# EAGLE design working (EAGLE 9.6.2)
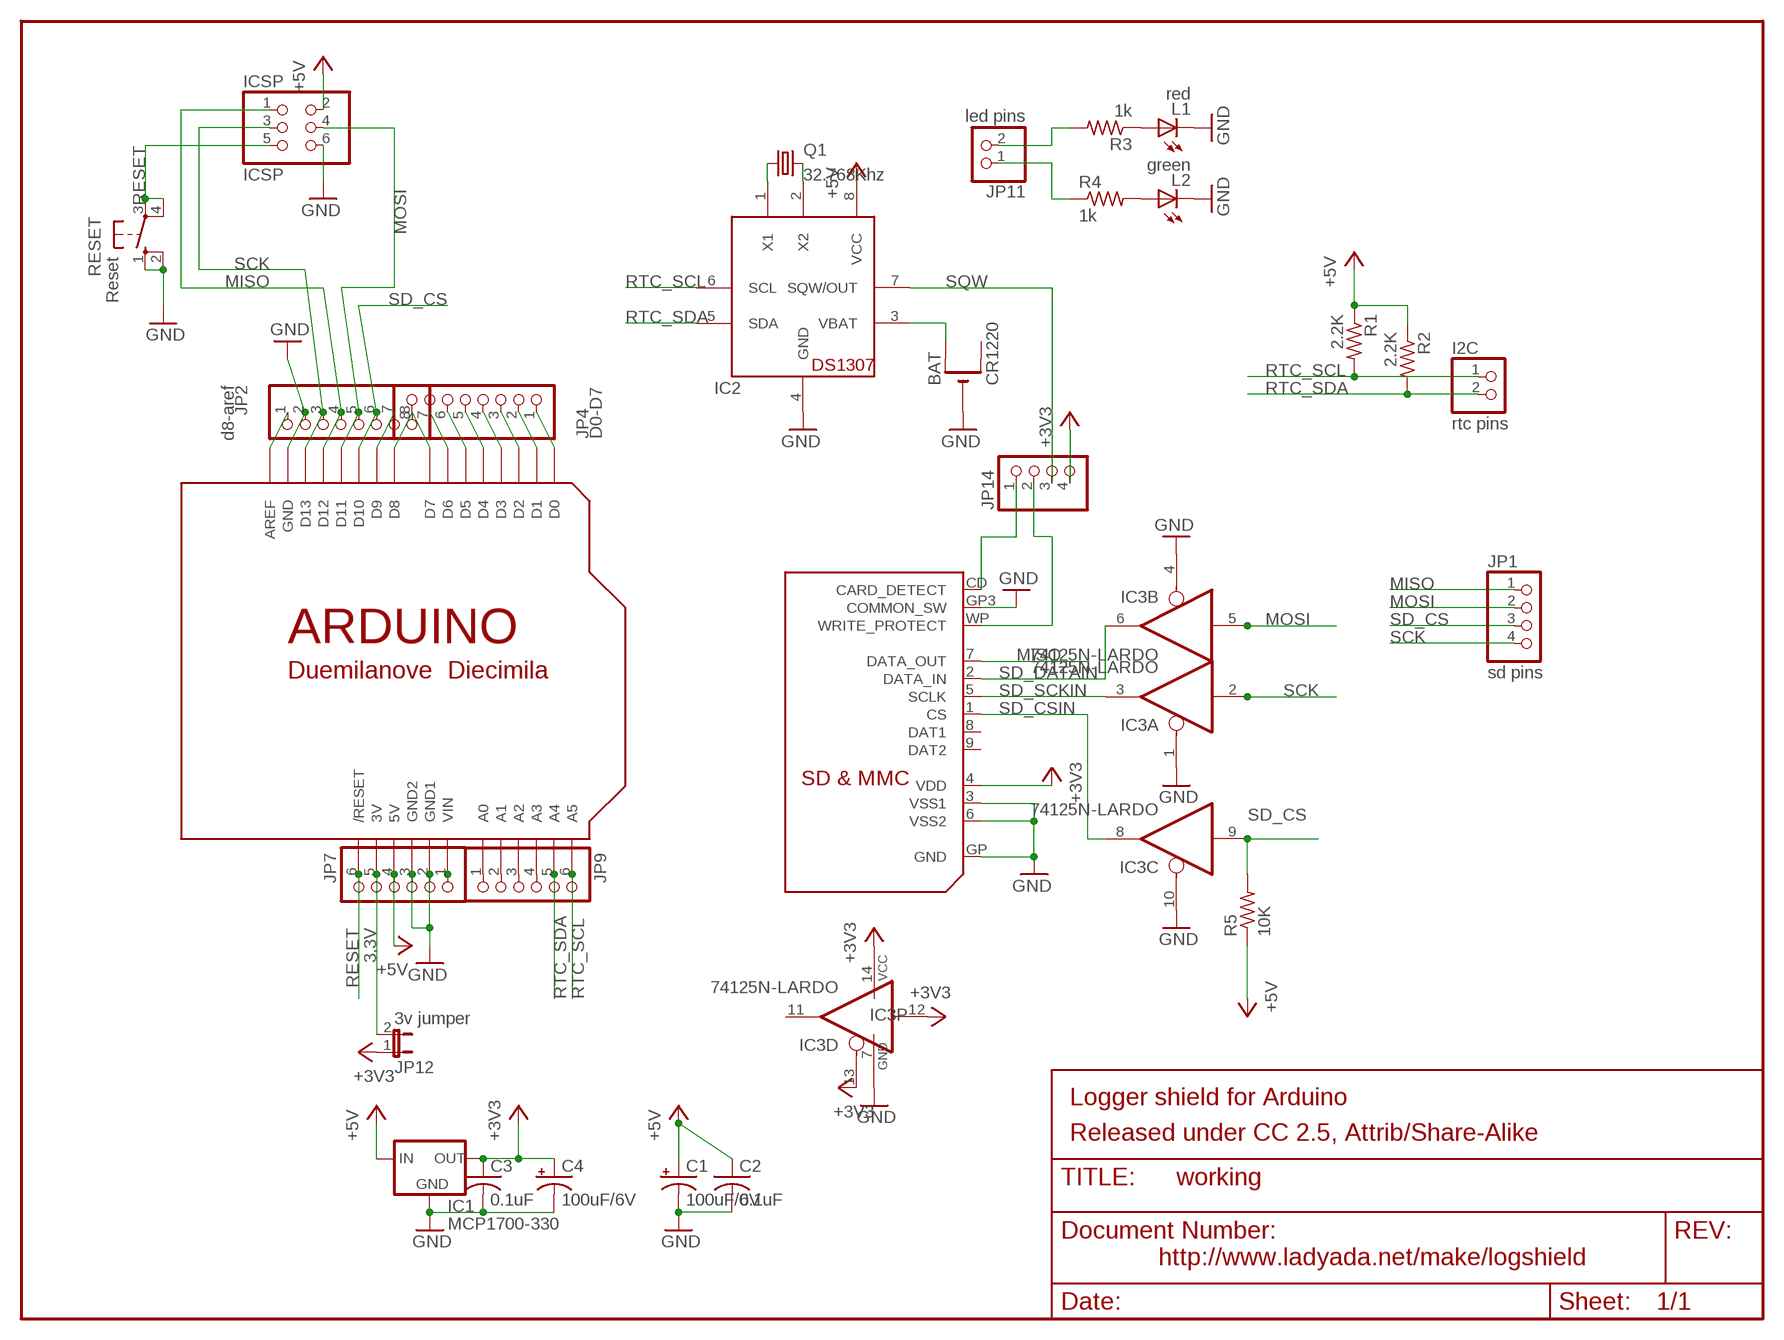
[diagram p0: schematic, sheet 1]

## Parts
BAT  CR1220  CR1220THM  [CR1220-THM]
C1  100uF/6V  CPOL-USE2.5-5  [E2,5-5]
C2  0.1uF  C-US025-025X050  [C025-025X050]
C3  0.1uF  C-US025-025X050  [C025-025X050]
C4  100uF/6V  CPOL-USE2.5-5  [E2,5-5]
I2C  rtc pins  PINHD-1X2  [1X02]
IC1  MCP1700-330  MCP1700TRI  [TO92]
IC2  DS1307  [DIL08]
IC3  74125N-LARDO  [DIL14-LARDO]
ICSP  ICSP  PINHD-2X3  [2X03]
JP1  sd pins  PINHD-1X4  [1X04]
JP2  d8-aref  PINHD-1X8BIG  [1X08-BIG]
JP4  D0-D7  PINHD-1X8BIG  [1X08-BIG]
JP7  PINHD-1X6B  [1X06-BIG]
JP9  PINHD-1X6B  [1X06-BIG]
JP11  led pins  PINHD-1X2  [1X02]
JP12  3v jumper  JP1E  [JP1]
JP14  PINHD-1X4  [1X04]
L1  red  LED3MM  [LED3MM]
L2  green  LED3MM  [LED3MM]
Q1  32.768Khz  CRYSTALTC38H  [TC38H]
R1  2.2K  R-US_0207/10  [0207/10]
R2  2.2K  R-US_0207/10  [0207/10]
R3  1k  R-US_0207/10  [0207/10]
R4  1k  R-US_0207/10  [0207/10]
R5  10K  R-US_0207/10  [0207/10]
RESET  Reset  10-XX  [B3F-10XX]
U$1  ARDUINODUEMILANOVE-NOHOLES  [ARDUINO-NOHOLE]
U$2  SDMMC06132  [06132]

## Nets
3.3V: JP7.5 JP12.2 U$1.3V
+3V3: C3.1 C4.+ IC1.3(OUT) IC3.12(D:I) IC3.13(D:OE) IC3.14(P:VCC) JP12.1 JP14.4 U$2.4(VDD)
+5V: C1.+ C2.1 IC1.2(IN) IC2.8(VCC) ICSP.2 JP7.4 R1.1 R2.1 R5.1 U$1.5V
GND: BAT.- C1.- C2.2 C3.2 C4.- IC1.1(GND) IC2.4(GND) IC3.1(A:OE) IC3.4(B:OE) IC3.7(P:GND) IC3.10(C:OE) ICSP.6 JP2.2 JP7.2 JP7.3 L1.K(C) L2.K(C) RESET.1(S) RESET.2(S1) U$1.GND U$1.GND1 U$1.GND2 U$2.3(VSS1) U$2.6(VSS2) U$2.GP3(COMMON_SW) U$2.GP(GND)
MISO: ICSP.1 JP1.1 JP2.4 U$1.D12 U$2.7(DATA_OUT)
MOSI: IC3.5(B:I) ICSP.4 JP1.2 JP2.5 U$1.D11
N$1: BAT.+1(+) IC2.3(VBAT)
N$2: IC2.1(X1) Q1.1
N$3: IC2.2(X2) Q1.2
N$14: L1.A R3.1
N$15: JP7.1 U$1.VIN
N$17: JP11.2 R3.2
N$18: L2.A R4.2
N$20: JP11.1 R4.1
N$87: JP4.1 U$1.D0
N$88: JP4.2 U$1.D1
N$89: JP4.3 U$1.D2
N$90: JP4.4 U$1.D3
N$98: JP4.5 U$1.D4
N$99: JP4.6 U$1.D5
N$100: JP4.7 U$1.D6
N$101: JP4.8 U$1.D7
N$108: JP2.1 U$1.AREF
N$110: JP2.7 U$1.D9
N$111: JP2.8 U$1.D8
N$154: JP9.1 U$1.A0
N$164: JP9.2 U$1.A1
N$181: JP9.3 U$1.A2
N$182: JP9.4 U$1.A3
RESET: ICSP.5 JP7.6 RESET.3(P) RESET.4(P1) U$1.RESET(/RESET)
RTC_SCL: I2C.1 IC2.6(SCL) JP9.6 R1.2 U$1.A5
RTC_SDA: I2C.2 IC2.5(SDA) JP9.5 R2.2 U$1.A4
SCK: IC3.2(A:I) ICSP.3 JP1.4 JP2.3 U$1.D13
SD_CD: JP14.1 U$2.CD(CARD_DETECT)
SD_CS: IC3.9(C:I) JP1.3 JP2.6 R5.2 U$1.D10
SD_CSIN: IC3.8(C:O) U$2.1(CS)
SD_DATAIN: IC3.6(B:O) U$2.2(DATA_IN)
SD_SCKIN: IC3.3(A:O) U$2.5(SCLK)
SD_WP: JP14.2 U$2.WP(WRITE_PROTECT)
SQW: IC2.7(SQW/OUT) JP14.3
Unconnected: BAT.+2(+1) IC3.11(D:O) U$2.8(DAT1) U$2.9(DAT2)

## Notes on the sheet
- Logger shield for Arduino
- Released under CC 2.5, Attrib/Share-Alike
- http://www.ladyada.net/make/logshield

## Library data of the parts
BAT = adafruit:CR1220: CR1216/CR1220/CR1225 12mm 3V lithium coin cell Great for battery packup. Both SMT and THM holders. Note the THM package has the ground pads on both sides of the PCB so that the masks are the same - this reduces the cost
C1 C4 = adafruit:CPOL-US: POLARIZED CAPACITOR, American symbol
C2 C3 = adafruit:C-US: CAPACITOR, American symbol
I2C JP11 = pinhead:PINHD-1X2: PIN HEADER
IC1 = adafruit:MCP1700: VOLTAGE REGULATOR
IC2 = adafruit:DS1307: DS1307 Real time clock (RTC) with battery backup ability. Talk to it via i2c
IC3 = adafruit:74*125: Quad bus BUFFER, 3-state
ICSP = pinhead:PINHD-2X3: PIN HEADER
JP1 JP14 = pinhead:PINHD-1X4: PIN HEADER
JP2 JP4 = adafruit:PINHD-1X8: PIN HEADER
JP7 JP9 = adafruit:PINHD-1X6: PIN HEADER
JP12 = jumper:JP1E: JUMPER
L1 L2 = adafruit:LED: LED OSRAM: - CHIPLED LG R971, LG N971, LY N971, LG Q971, LY Q971, LO R971, LY R971 LH N974, LH R974 LS Q976, LO Q976, LY Q976 LO Q996 - Hyper CHIPLED LW Q18S LB Q993, LB Q99A, LB R99A - SideLED LS A670, LO A670, LY A670, LG A670, LP A670 LB A673, LV A673, LT A673, LW A673 LH A674 LY A675 LS A676, LA A676, LO A676, LY A676, LW A676 LS A679, LY A679, LG A679 - Hyper Micro SIDELED® LS Y876, LA Y876, LO Y876, LY Y876 LT Y87S - SmartLED LW L88C, LW L88S LB L89C, LB L89S, LG L890 LS L89K, LO L89K, LY L89K LS L896, LA L896, LO L896, LY L896 - TOPLED LS T670, LO T670, LY T670, LG T670, LP T670 LSG T670, LSP T670, LSY T670, LOP T670, LYG T670 LG T671, LOG T671, LSG T671 LB T673, LV T673, LT T673, LW T673 LH T674 LS T676, LA T676, LO T676, LY T676, LB T676, LH T676, LSB T676, LW T676 LB T67C, LV T67C, LT T67C, LS T67K, LO T67K, LY T67K, LW E67C LS E67B, LA E67B, LO E67B, LY E67B, LB E67C, LV E67C, LT E67C LW T67C LS T679, LY T679, LG T679 LS T770, LO T770, LY T770, LG T770, LP T770 LB T773, LV T773, LT T773, LW T773 LH T774 LS E675, LA E675, LY E675, LS T675 LS T776, LA T776, LO T776, LY T776, LB T776 LHGB T686 LT T68C, LB T68C - Hyper Mini TOPLED® LB M676 - Mini TOPLED Santana® LG M470 LS M47K, LO M47K, LY M47K Source: http://www.osram.convergy.de/
Q1 = crystal:CRYSTAL: CRYSTAL
R1-R5 = adafruit:R-US_: RESISTOR, American symbol
RESET = switch-omron:10-XX: OMRON SWITCH
U$1 = adafruit:ARDUINO: Arduino Diecimila/Duemilanove Make a shield with ease, this package has all the named pins as well as the two mounting drill holes and an outline of the USB and DC power connector. The outline is on the DIMENSION layer, so if your board house uses it they will cut the outline to match. http://www.ladyada.net/library/pcb/eaglelibrary.html
U$2 = adafruit:SDMMC: SD MMC Card holder 4UCON part #06132 - easy to solder

## Board
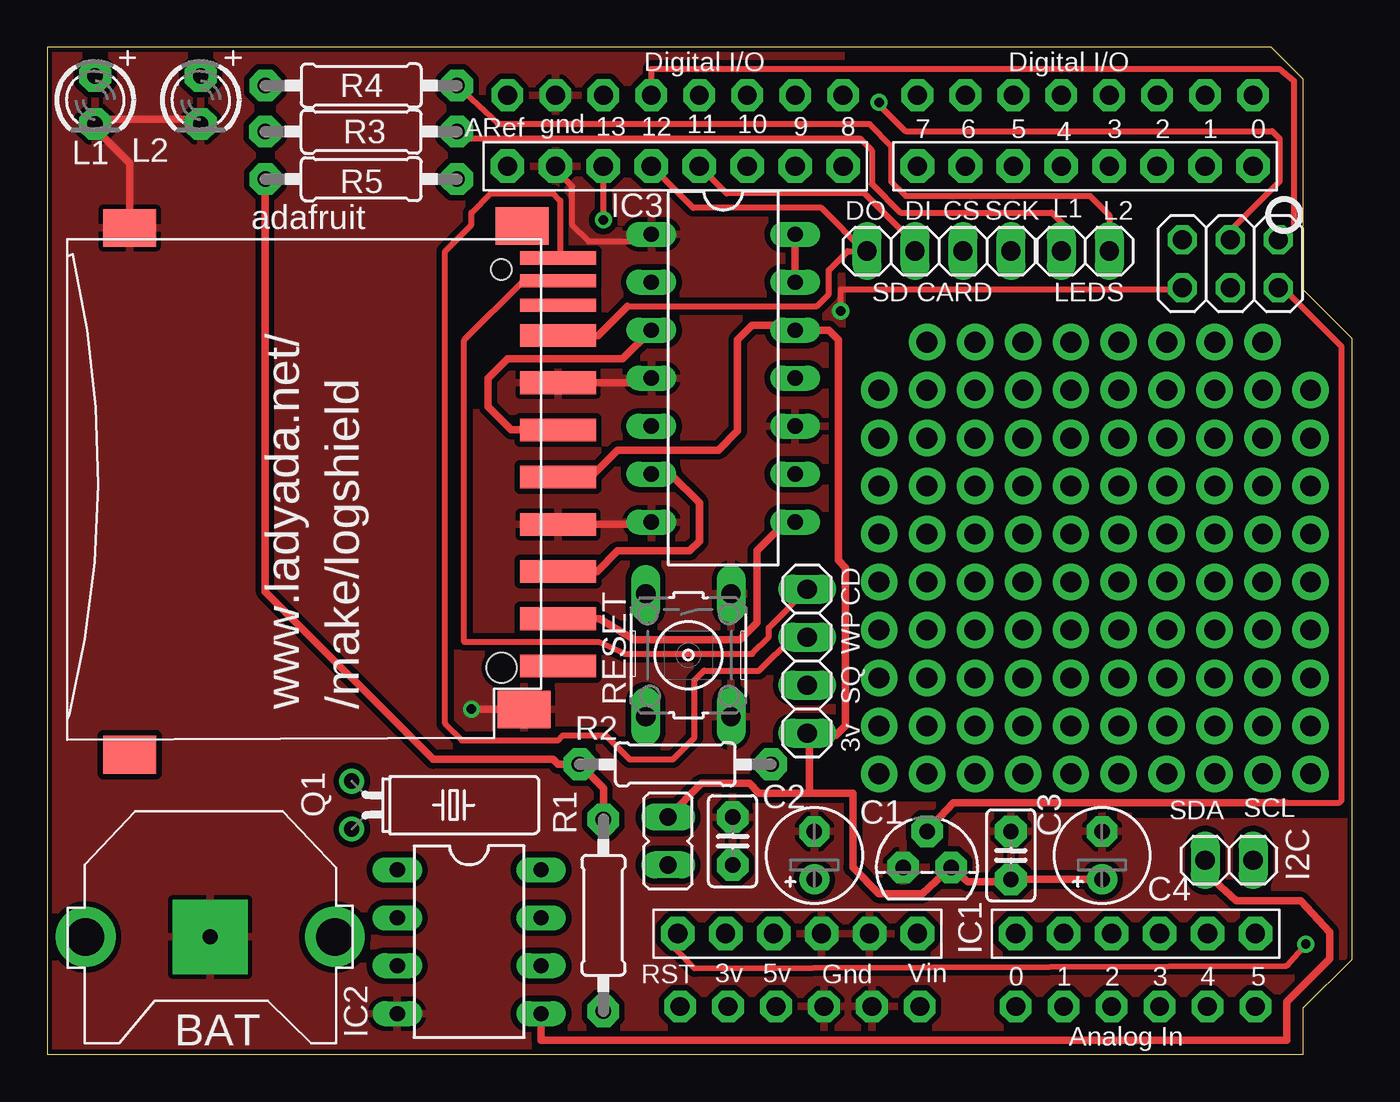
[diagram p1: board, top side]
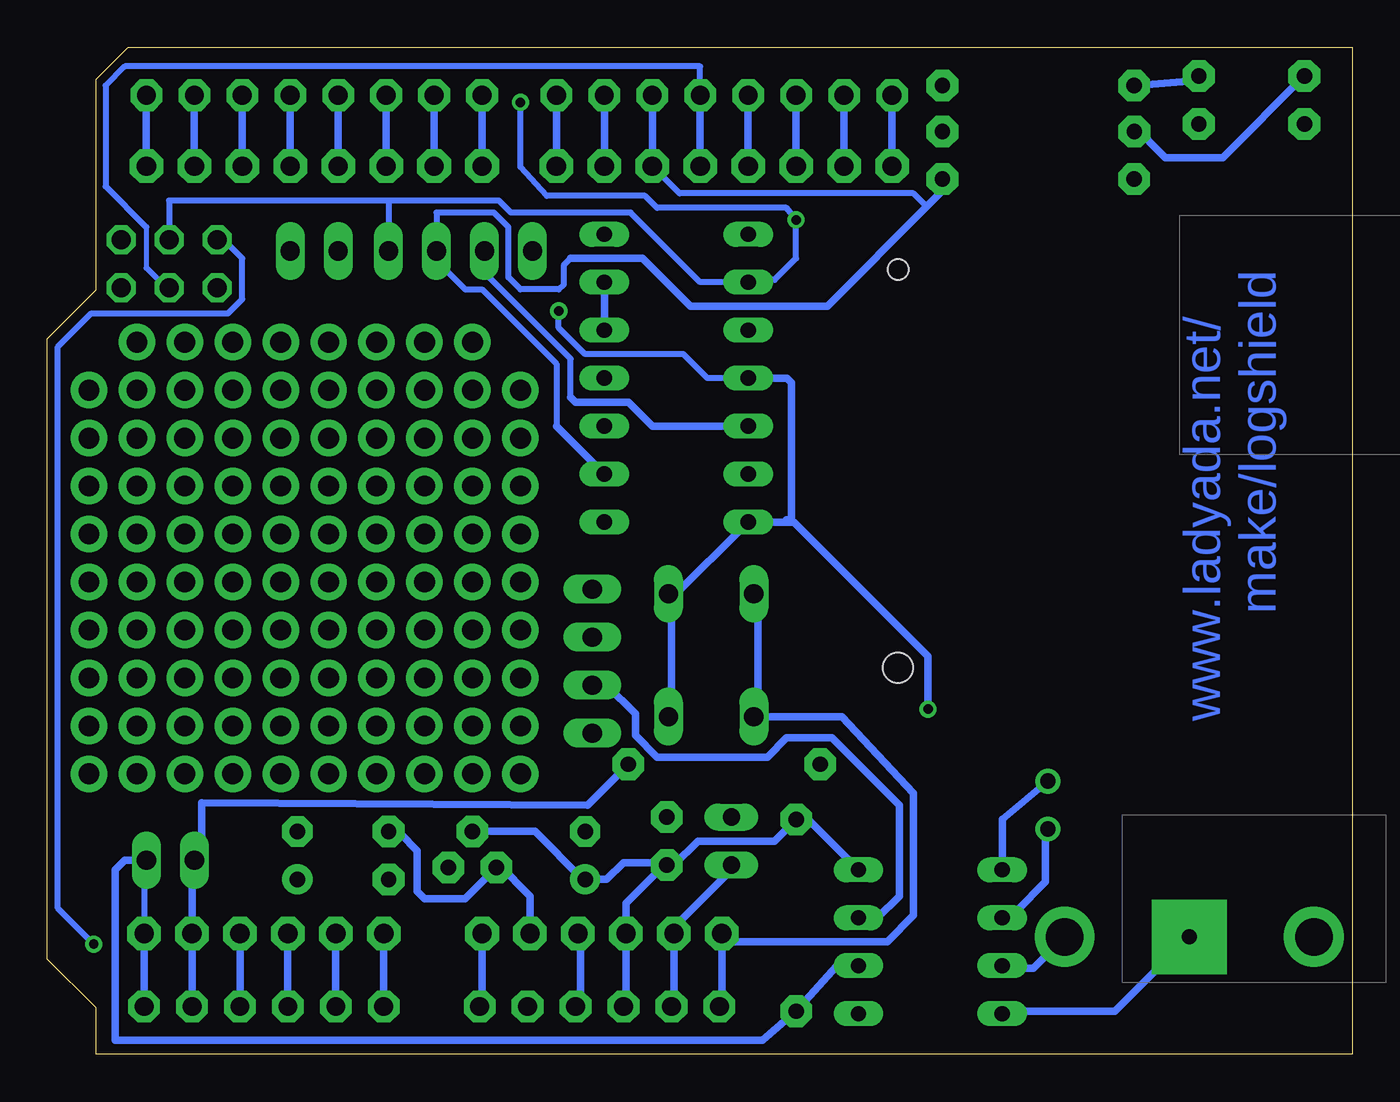
[diagram p2: board, bottom side, seen from below]

Size 69.14 x 53.34 mm. Coordinates in mm from the lower left corner, seen from the top.
Outline: 69.14,5.09 69.14,5.1
Copper layers (1*16): Top 0.035mm / dielectric 1.5mm / Bottom 0.035mm
Design rules "default *": minimum track width 10mil, minimum drill 19mil, track to track 12mil, track to pad 12mil, pad to pad 12mil, via to via 12mil, smd to smd 0mil, copper to edge 10mil, drill to drill 8mil, minimum pad ring 10mil, minimum via ring 8mil, stop-mask expansion 4mil, vias tented up to drill 20mil, thermal gap 10mil

### Footprints (pad centres in the part's own frame; a part is rotated, then mirrored left to right if it is on the bottom)
CR1220-THM = drill 2 pad 3.175: +1 -6.604,0; +2 6.604,0 | drill 0.8 pad 3.962 square: - 0,0
E2,5-5 = drill 0.813 pad 1.6: + -1.27,0 | drill 0.813 pad 1.6 octagon: - 1.27,0
C025-025X050 = drill 0.813 pad 1.676 octagon: 1 -1.27,0; 2 1.27,0
1X02 = drill 1.016 long: 1 -1.27,0; 2 1.27,0
TO92 = drill 0.813 pad 1.676 octagon: 1 -1.27,0; 2 0,1.905; 3 1.27,0
DIL08 = drill 0.813 long: 1 -3.81,-3.81; 2 -1.27,-3.81; 3 1.27,-3.81; 4 3.81,-3.81; 5 3.81,3.81; 6 1.27,3.81; 7 -1.27,3.81; 8 -3.81,3.81
DIL14-LARDO = drill 0.813 long: 1 -7.62,-3.81; 2 -5.08,-3.81; 3 -2.54,-3.81; 4 0,-3.81; 5 2.54,-3.81; 6 5.08,-3.81; 7 7.62,-3.81; 8 7.62,3.81; 9 5.08,3.81; 10 2.54,3.81; 11 0,3.81; 12 -2.54,3.81; 13 -5.08,3.81; 14 -7.62,3.81
2X03 = drill 1.016 octagon: 1 -2.54,-1.27; 2 -2.54,1.27; 3 0,-1.27; 4 0,1.27; 5 2.54,-1.27; 6 2.54,1.27
1X04 = drill 1.016 long: 1 -3.81,0; 2 -1.27,0; 3 1.27,0; 4 3.81,0
1X08-BIG = drill 1.016 pad 1.778 octagon: 1 -8.89,0; 2 -6.35,0; 3 -3.81,0; 4 -1.27,0; 5 1.27,0; 6 3.81,0; 7 6.35,0; 8 8.89,0
1X06-BIG = drill 1.016 pad 1.778 octagon: 1 -6.35,0; 2 -3.81,0; 3 -1.27,0; 4 1.27,0; 5 3.81,0; 6 6.35,0
JP1 = drill 0.914 long: 1 0,-1.27; 2 0,1.27
LED3MM = drill 0.813 pad 1.676 octagon: A -1.27,0; K 1.27,0
TC38H = drill 0.813: 1 -1.27,0; 2 1.27,0
0207/10 = drill 0.813 pad 1.676 octagon: 1 -5.08,0; 2 5.08,0
B3F-10XX = drill 1.016 long: 1 -3.251,2.261; 2 3.251,2.261; 3 -3.251,-2.261; 4 3.251,-2.261
ARDUINO-NOHOLE = drill 1 pad 1.676 octagon: 3V 36.068,2.54; 5V 38.608,2.54; A0 51.308,2.54; A1 53.848,2.54; A2 56.388,2.54; A3 58.928,2.54; A4 61.468,2.54; A5 64.008,2.54; AREF 24.384,50.8; D0 63.881,50.8; D1 61.341,50.8; D2 58.801,50.8; D3 56.261,50.8; D4 53.721,50.8; D5 51.181,50.8; D6 48.641,50.8; D7 46.101,50.8; D8 42.164,50.8; D9 39.624,50.8; D10 37.084,50.8; D11 34.544,50.8; D12 32.004,50.8; D13 29.464,50.8; GND 26.924,50.8; GND1 43.688,2.54; GND2 41.148,2.54; RESET 33.528,2.54; VIN 46.228,2.54
06132 = smd 1.2 x 4: 1 6.9,0.9; 2 4.4,0.9; 3 1.9,0.9; 4 -0.6,0.9; 5 -3.1,0.9; 6 -5.6,0.9; 7 -8.1,0.9; 9 9.4,0.9 | smd 0.7 x 4: 8 -9.7,0.9; CD -11,0.9; WP -12.2,0.9 | smd 2 x 2.8: GP -13.8,-21.8; GP2 14.1,-21.8; GP3 11.7,-0.9; GP4 -13.9,-1 | hole 1.1: -11.6,-2.1 | hole 1.6: 9.5,-2.1

### Placement (x,y rotation side)
BAT  8.64,6.22 180 top
C1  40.64,10.54 90 top
C2  36.31,11.3 90 top
C3  51.05,10.54 90 top
C4  55.88,10.54 90 top
I2C  62.61,10.29 180 top
IC1  46.61,9.91 0 top
IC2  22.35,5.97 270 top
IC3  35.81,35.81 270 top
ICSP  62.68,41.87 180 top
JP1  47.24,42.55 0 top
JP2  33.27,47.04 0 top
JP4  54.99,47.04 180 top
JP7  39.75,6.4 180 top
JP9  57.66,6.4 0 top
JP11  54.99,42.55 180 top
JP12  32.89,11.3 180 top
JP14  40.26,20.83 270 top
L1  2.54,50.55 270 top
L2  8.13,50.55 270 top
Q1  16.13,13.21 270 top
R1  29.46,7.37 270 top
R2  33.27,15.37 0 top
R3  16.63,48.87 0 top
R4  16.64,51.31 180 top
R5  16.64,46.35 0 top
RESET  33.97,21.14 270 top
U$1  0,0 0 top
U$2  26.16,29.97 270 top

### Tracks (layer width: path | path; a pad name or v marks a point on that pad's centre or on a via)
3.3V
  Bottom 0.406: 35.94,7.11 JP7.5 35.94,6.35 | 35.94,7.11 36.07,7.11 36.07,6.35 35.94,6.35 | 35.94,6.35 35.81,6.35 | JP12.2 32.89,9.78 35.56,7.11 35.94,7.11 | U$1.3V 35.94,2.54 35.94,6.35
+3V3
  Top 0.406: U$2.4 28.79,30.57 30.23,32 35.56,32 36.58,33.02 36.58,37.85 37.34,38.61 39.62,38.61 IC3.12 41.4,38.35 41.91,37.85 41.91,26.16 42.29,25.78 42.29,17.4 41.78,16.89 40.39,16.89 | IC3.13 IC3.14 | C4.+ C3.1 51.05,9.14 48.77,9.14 IC1.3 46.35,8.51 44.07,8.51 42.67,9.91 42.67,13.84 40.39,13.84 | JP12.1 34.67,14.35 37.21,14.35 37.72,13.84 40.39,13.84 | 40.39,13.84 40.39,16.89 | 40.39,16.89 JP14.4
  Bottom 0.406: IC3.12 IC3.13
+5V
  Top 0.305: 65.66,13.34 arc-90 65.53,13.34 68.45,13.34 68.58,13.46 68.58,37.47 65.53,40.51 65.15,40.51 65.15,40.53 ICSP.2
  Top 0.406: IC2.8 26.16,9.91 | R5.1 11.56,24.51 20.45,15.62 26.8,15.62 27.05,15.37 R2.1 29.46,14.1 29.46,12.83 | IC1.2 48.01,13.34 65.53,13.34 | 29.46,12.83 29.46,12.95 | R1.1 29.46,12.83
  Bottom 0.406: 38.35,6.35 38.48,6.35 JP7.4 38.48,6.48 | 38.48,6.48 38.48,8 36.58,9.91 | 36.58,9.91 36.45,10.03 C2.1 | 36.58,9.91 36.83,10.16 38.61,10.16 39.5,9.27 C1.+ 40.77,9.27 43.31,11.81 IC1.2 | IC2.8 28.83,12.45 R1.1 30.61,11.3 34.67,11.3 35.94,10.03 C2.1 | U$1.5V 38.48,2.54 38.48,6.48 | C2.1 36.32,10.03
GND  (via drill 0.5)
  Top 0.305: ICSP.6 60.05,40.51 42.04,40.51 v42.04,39.37 | 26.92,46.86 27.81,45.97 27.81,43.94 28.7,43.05 31.62,43.05 IC3.1
  Top 0.406: U$2.GP 4.36,47.2 2.54,49.02 L1.K 2.54,49.53 7.87,49.53 L2.K | IC3.7 32.26,28.19 32.14,28.07 U$2.3 | IC3.4 31.75,35.81 31.51,35.57 U$2.6 | 26.92,46.86 JP2.2 | U$2.GP3 22.5,18.27 v22.48,18.29
  Bottom 0.305: v42.04,39.37 42.04,38.48 40.64,37.08 35.43,37.08 34.16,35.81 IC3.4
  Bottom 0.406: IC2.4 18.54,2.29 12.57,2.29 BAT.- | RESET.2 36.07,17.99 36.07,24.3 RESET.1 35.82,24.39 35.81,24.38 32.26,27.94 32.26,28.19 IC3.7 29.97,28.19 | 29.97,28.19 29.72,28.19 29.72,35.57 29.96,35.81 IC3.4 | v22.48,18.29 22.48,21.08 29.59,28.19 29.84,28.19 29.97,28.32 29.97,28.19 | JP7.3 40.97,6.35 40.89,6.35 40.89,2.85 | JP7.2 43.56,8.38 45.21,10.03 IC1.1 46.99,8.26 49.15,8.26 49.53,8.64 49.53,10.79 50.42,11.68 51.05,11.68 C3.2 | U$1.GND 26.8,50.67 26.92,50.55 JP2.2
  pour Top: 69.09,-0.25 69.34,12.32 57.28,12.32 57.28,12.95 56.9,13.21 41.91,13.21 42.16,20.32 42.04,53.59 0.13,53.85 0.25,0
MISO
  Top 0.305: 30.73,39.62 40.77,39.62 41.4,40.26 41.4,41.53 42.42,42.55 JP1.1 43.31,42.55 41.02,44.83 34.21,44.83 JP2.4 | ICSP.1 65.22,43.11 65.28,43.05 66.04,43.81 66.04,51.56 65.28,52.2 32,52.2 32,51.05 31.88,50.93 U$1.D12
  Top 0.406: U$2.7 29.18,38.07 30.73,39.62
  Bottom 0.406: JP2.4 U$1.D12
MOSI
  Top 0.305: JP2.5 35.99,45.59 43.31,45.59 45.97,42.93 JP1.2
  Bottom 0.254: 63.88,43.81 63.88,41.66
  Bottom 0.305: 41.4,34.8 41.4,36.83 45.97,41.4 JP1.2 | 63.88,43.81 66.04,45.97 66.04,51.31 65.02,52.32 34.54,52.32 U$1.D11 | ICSP.4 62.68,40.57 62.74,40.51 63.88,41.66
  Bottom 0.406: IC3.5 37.08,33.27 38.35,34.54 41.15,34.54 41.4,34.8 | JP2.5 U$1.D11
N$1
  Bottom 0.406: 18.67,4.57 18.8,4.57 | 18.67,4.57 IC2.3 | BAT.+1 16.89,4.57 18.67,4.57
N$2
  Bottom 0.406: Q1.1 18.54,12.45 IC2.1
N$3
  Bottom 0.406: Q1.2 16.26,12.19 16.26,9.14 17.78,7.62 18.54,7.62 IC2.2
N$4  (via drill 1.1 pad 1.93)
  other vias: 44.07,30.1
N$5  (via drill 1.1 pad 1.93)
  other vias: 49.15,37.72
N$6  (via drill 1.1 pad 1.93)
  other vias: 51.69,37.72
N$7  (via drill 1.1 pad 1.93)
  other vias: 46.61,37.72
N$8  (via drill 1.1 pad 1.93)
  other vias: 44.07,35.18
N$9  (via drill 1.1 pad 1.93)
  other vias: 54.23,37.72
N$10  (via drill 1.1 pad 1.93)
  other vias: 44.07,32.64
N$11  (via drill 1.1 pad 1.93)
  other vias: 56.77,35.18
N$12  (via drill 1.1 pad 1.93)
  other vias: 44.07,17.4
N$13  (via drill 1.1 pad 1.93)
  other vias: 61.85,32.64
N$14
  Bottom 0.406: L1.A 6.86,47.5 9.91,47.5 11.68,49.28 11.57,49.28 R3.1
N$15
  Bottom 0.406: 46.1,6.48 46.1,6.86 45.97,6.86 | 46.1,6.48 JP7.1 | U$1.VIN 46.1,2.54 46.1,6.48
N$16  (via drill 1.1 pad 1.93)
  other vias: 56.77,37.72
N$17
  Top 0.305: R3.2 21.71,49.27 21.72,49.28 22.48,48.51 43.05,48.51 43.69,47.88 43.69,46.1 45.21,44.58 53.21,44.58 53.85,43.94 53.85,42.42 JP11.2
N$18
  Bottom 0.406: 11.94,51.56 R4.2 8.38,51.56 L2.A
N$19  (via drill 1.1 pad 1.93)
  other vias: 59.31,37.72
N$20
  Top 0.305: R4.1 23.88,49.28 43.56,49.28 44.7,48.13 44.7,46.23 45.47,45.47 55.24,45.47 56.26,44.45 JP11.1
N$21  (via drill 1.1 pad 1.93)
  other vias: 61.85,30.1
N$22  (via drill 1.1 pad 1.93)
  other vias: 61.85,27.56
N$23  (via drill 1.1 pad 1.93)
  other vias: 61.85,25.02
N$24  (via drill 1.1 pad 1.93)
  other vias: 61.85,35.18
N$25  (via drill 1.1 pad 1.93)
  other vias: 59.31,35.18
N$26  (via drill 1.1 pad 1.93)
  other vias: 64.39,25.02
N$27  (via drill 1.1 pad 1.93)
  other vias: 54.23,35.18
N$28  (via drill 1.1 pad 1.93)
  other vias: 51.69,35.18
N$29  (via drill 1.1 pad 1.93)
  other vias: 49.15,35.18
N$30  (via drill 1.1 pad 1.93)
  other vias: 46.61,35.18
N$31  (via drill 1.1 pad 1.93)
  other vias: 46.61,32.64
N$32  (via drill 1.1 pad 1.93)
  other vias: 49.15,32.64
N$33  (via drill 1.1 pad 1.93)
  other vias: 51.69,32.64
N$34  (via drill 1.1 pad 1.93)
  other vias: 54.23,32.64
N$35  (via drill 1.1 pad 1.93)
  other vias: 56.77,32.64
N$36  (via drill 1.1 pad 1.93)
  other vias: 59.31,32.64
N$37  (via drill 1.1 pad 1.93)
  other vias: 61.85,14.86
N$38  (via drill 1.1 pad 1.93)
  other vias: 64.39,37.72
N$39  (via drill 1.1 pad 1.93)
  other vias: 66.93,25.02
N$40  (via drill 1.1 pad 1.93)
  other vias: 66.93,27.56
N$41  (via drill 1.1 pad 1.93)
  other vias: 64.39,17.4
N$42  (via drill 1.1 pad 1.93)
  other vias: 46.61,30.1
N$43  (via drill 1.1 pad 1.93)
  other vias: 49.15,30.1
N$44  (via drill 1.1 pad 1.93)
  other vias: 51.69,30.1
N$45  (via drill 1.1 pad 1.93)
  other vias: 54.23,30.1
N$46  (via drill 1.1 pad 1.93)
  other vias: 56.77,30.1
N$47  (via drill 1.1 pad 1.93)
  other vias: 59.31,30.1
N$48  (via drill 1.1 pad 1.93)
  other vias: 64.39,30.1
N$49  (via drill 1.1 pad 1.93)
  other vias: 64.39,14.86
N$50  (via drill 1.1 pad 1.93)
  other vias: 66.93,30.1
N$51  (via drill 1.1 pad 1.93)
  other vias: 54.23,14.86
N$52  (via drill 1.1 pad 1.93)
  other vias: 64.39,32.64
N$53  (via drill 1.1 pad 1.93)
  other vias: 66.93,14.86
N$54  (via drill 1.1 pad 1.93)
  other vias: 66.93,17.4
N$55  (via drill 1.1 pad 1.93)
  other vias: 64.39,27.56
N$56  (via drill 1.1 pad 1.93)
  other vias: 59.31,27.56
N$57  (via drill 1.1 pad 1.93)
  other vias: 56.77,27.56
N$58  (via drill 1.1 pad 1.93)
  other vias: 54.23,27.56
N$59  (via drill 1.1 pad 1.93)
  other vias: 51.69,27.56
N$60  (via drill 1.1 pad 1.93)
  other vias: 49.15,27.56
N$61  (via drill 1.1 pad 1.93)
  other vias: 46.61,27.56
N$62  (via drill 1.1 pad 1.93)
  other vias: 66.93,22.48
N$63  (via drill 1.1 pad 1.93)
  other vias: 66.93,19.94
N$64  (via drill 1.1 pad 1.93)
  other vias: 61.85,19.94
N$65  (via drill 1.1 pad 1.93)
  other vias: 64.39,22.48
N$66  (via drill 1.1 pad 1.93)
  other vias: 46.61,25.02
N$67  (via drill 1.1 pad 1.93)
  other vias: 49.15,25.02
N$68  (via drill 1.1 pad 1.93)
  other vias: 51.69,25.02
N$69  (via drill 1.1 pad 1.93)
  other vias: 54.23,25.02
N$70  (via drill 1.1 pad 1.93)
  other vias: 56.77,25.02
N$71  (via drill 1.1 pad 1.93)
  other vias: 59.31,25.02
N$72  (via drill 1.1 pad 1.93)
  other vias: 66.93,35.18
N$73  (via drill 1.1 pad 1.93)
  other vias: 66.93,32.64
N$74  (via drill 1.1 pad 1.93)
  other vias: 61.85,37.72
N$75  (via drill 1.1 pad 1.93)
  other vias: 59.31,14.86
N$76  (via drill 1.1 pad 1.93)
  other vias: 56.77,14.86
N$77  (via drill 1.1 pad 1.93)
  other vias: 49.15,14.86
N$78  (via drill 1.1 pad 1.93)
  other vias: 46.61,22.48
N$79  (via drill 1.1 pad 1.93)
  other vias: 49.15,22.48
N$80  (via drill 1.1 pad 1.93)
  other vias: 51.69,22.48
N$81  (via drill 1.1 pad 1.93)
  other vias: 54.23,22.48
N$82  (via drill 1.1 pad 1.93)
  other vias: 56.77,22.48
N$83  (via drill 1.1 pad 1.93)
  other vias: 59.31,22.48
N$84  (via drill 1.1 pad 1.93)
  other vias: 61.85,22.48
N$85  (via drill 1.1 pad 1.93)
  other vias: 46.61,14.86
N$86  (via drill 1.1 pad 1.93)
  other vias: 51.69,14.86
N$87
  Bottom 0.406: U$1.D0 64.01,50.8 63.88,50.67 JP4.1
N$88
  Bottom 0.406: 61.34,46.99 JP4.2 U$1.D1
N$89
  Bottom 0.406: JP4.3 U$1.D2
N$90
  Bottom 0.406: U$1.D3 56.13,50.8 56.26,50.67 JP4.4
N$91  (via drill 1.1 pad 1.93)
  other vias: 64.39,19.94
N$92  (via drill 1.1 pad 1.93)
  other vias: 59.31,19.94
N$93  (via drill 1.1 pad 1.93)
  other vias: 56.77,19.94
N$94  (via drill 1.1 pad 1.93)
  other vias: 54.23,19.94
N$95  (via drill 1.1 pad 1.93)
  other vias: 51.69,19.94
N$96  (via drill 1.1 pad 1.93)
  other vias: 49.15,19.94
N$97  (via drill 1.1 pad 1.93)
  other vias: 46.61,19.94
N$98
  Bottom 0.406: JP4.5 U$1.D4
N$99
  Bottom 0.406: JP4.6 U$1.D5
N$100
  Bottom 0.406: JP4.7 U$1.D6
N$101
  Bottom 0.406: JP4.8 U$1.D7
N$102  (via drill 1.1 pad 1.93)
  other vias: 46.61,17.4
N$103  (via drill 1.1 pad 1.93)
  other vias: 49.15,17.4
N$104  (via drill 1.1 pad 1.93)
  other vias: 51.69,17.4
N$105  (via drill 1.1 pad 1.93)
  other vias: 54.23,17.4
N$106  (via drill 1.1 pad 1.93)
  other vias: 56.77,17.4
N$107  (via drill 1.1 pad 1.93)
  other vias: 59.31,17.4
N$108
  Bottom 0.406: JP2.1 U$1.AREF
N$109  (via drill 1.1 pad 1.93)
  other vias: 61.85,17.4
N$110
  Bottom 0.406: JP2.7 U$1.D9
N$111
  Bottom 0.406: U$1.D8 42.04,50.67 42.16,50.55 JP2.8
N$112  (via drill 1.1 pad 1.93)
  other vias: 44.07,27.56
N$113  (via drill 1.1 pad 1.93)
  other vias: 44.07,25.02
N$114  (via drill 1.1 pad 1.93)
  other vias: 44.07,22.48
N$115  (via drill 1.1 pad 1.93)
  other vias: 44.07,19.94
N$116  (via drill 1.1 pad 1.93)
  other vias: 44.07,14.86
N$117  (via drill 1.1 pad 1.93)
  other vias: 64.39,35.18
N$154
  Bottom 0.406: U$1.A0 JP9.1
N$164
  Bottom 0.406: 53.85,6.48 JP9.2 | U$1.A1 53.85,6.48 | 53.85,6.48 53.98,6.6
N$181
  Bottom 0.406: 56.39,6.35 JP9.3 56.44,6.4 | 56.39,6.35 56.64,6.35 | 56.44,6.4 56.52,6.48 | U$1.A2 56.39,6.35 | 56.39,6.35 56.44,6.4
N$182
  Bottom 0.406: 58.93,6.35 59.18,6.35 | 58.93,6.35 JP9.4 | U$1.A3 58.93,6.35
RESET  (via drill 0.5)
  Top 0.305: v66.67,5.84 65.66,4.7 34.29,4.57 33.27,5.59 33.27,6.27 JP7.6
  Bottom 0.305: v66.67,5.84 68.58,7.75 68.58,37.47 66.8,39.24 59.56,39.24 58.8,40.01 58.8,42.16 59.82,43.18 60.18,43.18 | 60.18,43.18 60.2,43.18 | 60.18,43.18 ICSP.5
  Bottom 0.406: 33.4,6.35 33.27,6.35 | RESET.4 31.45,18.24 31.5,18.29 31.45,18.33 | RESET.4 27.04,17.89 23.24,13.84 23.24,7.37 24.64,5.97 32.77,5.97 33.53,6.35 33.48,6.4 JP7.6 33.4,6.35 | RESET.4 31.5,17.93 31.5,24.35 RESET.3 | U$1.RESET 33.4,2.54 33.4,6.35
RTC_SCL
  Bottom 0.305: U$1.A5 64.01,10.16 I2C.1
  Bottom 0.406: IC2.6 27.3,4.7 R1.2 31.24,0.76 65.53,0.76 65.53,9.78 65.02,10.29 I2C.1 | 64.01,6.35 63.75,6.35 | 64.01,6.35 JP9.6 | U$1.A5 64.01,6.35
RTC_SDA
  Top 0.406: IC2.5 26.16,0.76 65.66,0.76 65.66,2.79 67.94,5.08 67.94,6.48 66.42,8.13 62.99,8.13 61.59,9.4 61.59,10.79 61.47,10.67 I2C.2
  Bottom 0.406: 61.47,6.6 61.72,6.35 61.47,6.35 JP9.5 61.47,6.6 | 61.47,6.6 61.47,10.29 I2C.2 61.21,10.79 61.21,10.92 60.96,10.92 60.96,13.34 40.51,13.21 R2.2 | 61.47,6.6 U$1.A4
SCK  (via drill 0.5)
  Top 0.305: v44.07,50.42 44.07,50.29 45.47,48.9 64.9,48.9 65.28,48.51 65.28,46.23 62.61,43.56 62.68,43.49 ICSP.3 | v29.46,44.2 JP2.3
  Bottom 0.305: v44.07,50.42 44.07,46.99 42.67,45.47 37.47,45.47 36.83,44.83 29.97,44.83 v29.46,44.2 29.46,42.16 30.61,41.02 31.88,41.02 IC3.2 34.54,40.89 38.23,44.58 44.58,44.58 45.21,45.21 51.05,45.21 | 51.05,45.21 JP1.4 | ICSP.3 62.68,45.21 51.05,45.21
  Bottom 0.406: IC3.2 32,41.15 32.77,41.15 | U$1.D13 29.34,50.67 29.46,50.55 JP2.3
SD_CD
  Top 0.305: 27.14,40.89 27.18,40.89 | 27.14,40.89 U$2.CD | 27.14,40.89 25.15,40.89 22.1,37.85 22.1,21.84 29.21,21.84 30.61,21.21 37.34,21.21 38.23,22.1 38.23,22.61 JP14.1
SD_CS
  Bottom 0.305: 42.16,33.27 42.16,36.58 46.1,40.51 46.99,40.51 48.51,42.04 JP1.3 48.51,44.58 45.47,44.58 44.7,43.81 44.7,41.15 44.07,40.51 42.04,40.51 41.78,40.77 41.78,41.78 41.4,42.16 | JP2.6 35.64,45.59 23.24,45.59 22.61,44.96 22.48,44.96
  Bottom 0.406: 39.12,30.73 IC3.9 42.16,33.27 | R5.2 21.84,45.59 22.48,44.96 27.81,39.62 35.05,39.62 37.59,42.16 41.4,42.16 | JP2.6 U$1.D10
SD_CSIN
  Top 0.406: U$2.1 29.25,23.07 31.11,21.97 36.7,21.97 37.59,22.86 37.59,26.67 39.12,28.19 IC3.8
SD_DATAIN
  Top 0.406: U$2.2 29.13,25.57 30.23,26.67 34.04,26.67 34.54,27.18 34.54,29.21 33.02,30.73 IC3.6
SD_SCKIN
  Top 0.406: U$2.5 24.59,33.07 23.37,34.29 23.37,35.81 24.38,36.83 30.48,36.83 IC3.3 32.26,38.61
SD_WP
  Top 0.305: U$2.WP 27.18,42.29 27.18,45.21 26.8,45.59 23.5,45.59 22.48,44.58 22.48,43.94 21.08,42.55 21.08,17.53 21.97,16.64 26.67,16.64 27.05,16.64 27.3,16.89 29.59,16.89 30.86,15.62 33.15,15.62 34.29,16.76 34.29,19.81 34.8,20.32 37.72,20.32 39.5,22.1 JP14.2 40.51,22.1
SQW
  Bottom 0.406: IC2.7 25.15,7.24 24,8.38 24,13.21 27.56,16.76 29.97,16.76 30.99,15.75 36.83,15.75 37.97,16.89 37.97,18.03 39.5,19.56 JP14.3

### Text on the board
Bottom: make/logshield | www.ladyada.net/
tPlace: DO | DI | CS | SCK | L1 | L2 | adafruit | SD CARD | LEDS | CD | WP | SQ | www.ladyada.net/ | /make/logshield | 3v | SCL | SDA